# EAGLE design KELU1-0233 (EAGLE 7.6.0)
ESKD_DATE1: 50|51|46|48|49|46|50|48|49|57; ESKD_DESCRIPTION1: 193|235|238|234|32|226|251|239|240|255|236|232|242|229|235|255; ESKD_DESCRIPTION2: 209|245|229|236|224|32|253|235|229|234|242|240|232|247|229|241|234|224|255; ESKD_DESCRIPTION3: 239|240|232|237|246|232|239|232|224|235|252|237|224|255|46; ESKD_NUMBER: 75|69|76|85|49|46|48|50|51|51|46|48|48|49|32|221|51; ESKD_ORIENTATION: 48; ESKD_PAPER_SIZE: 49; ESKD_SHEETS: 49
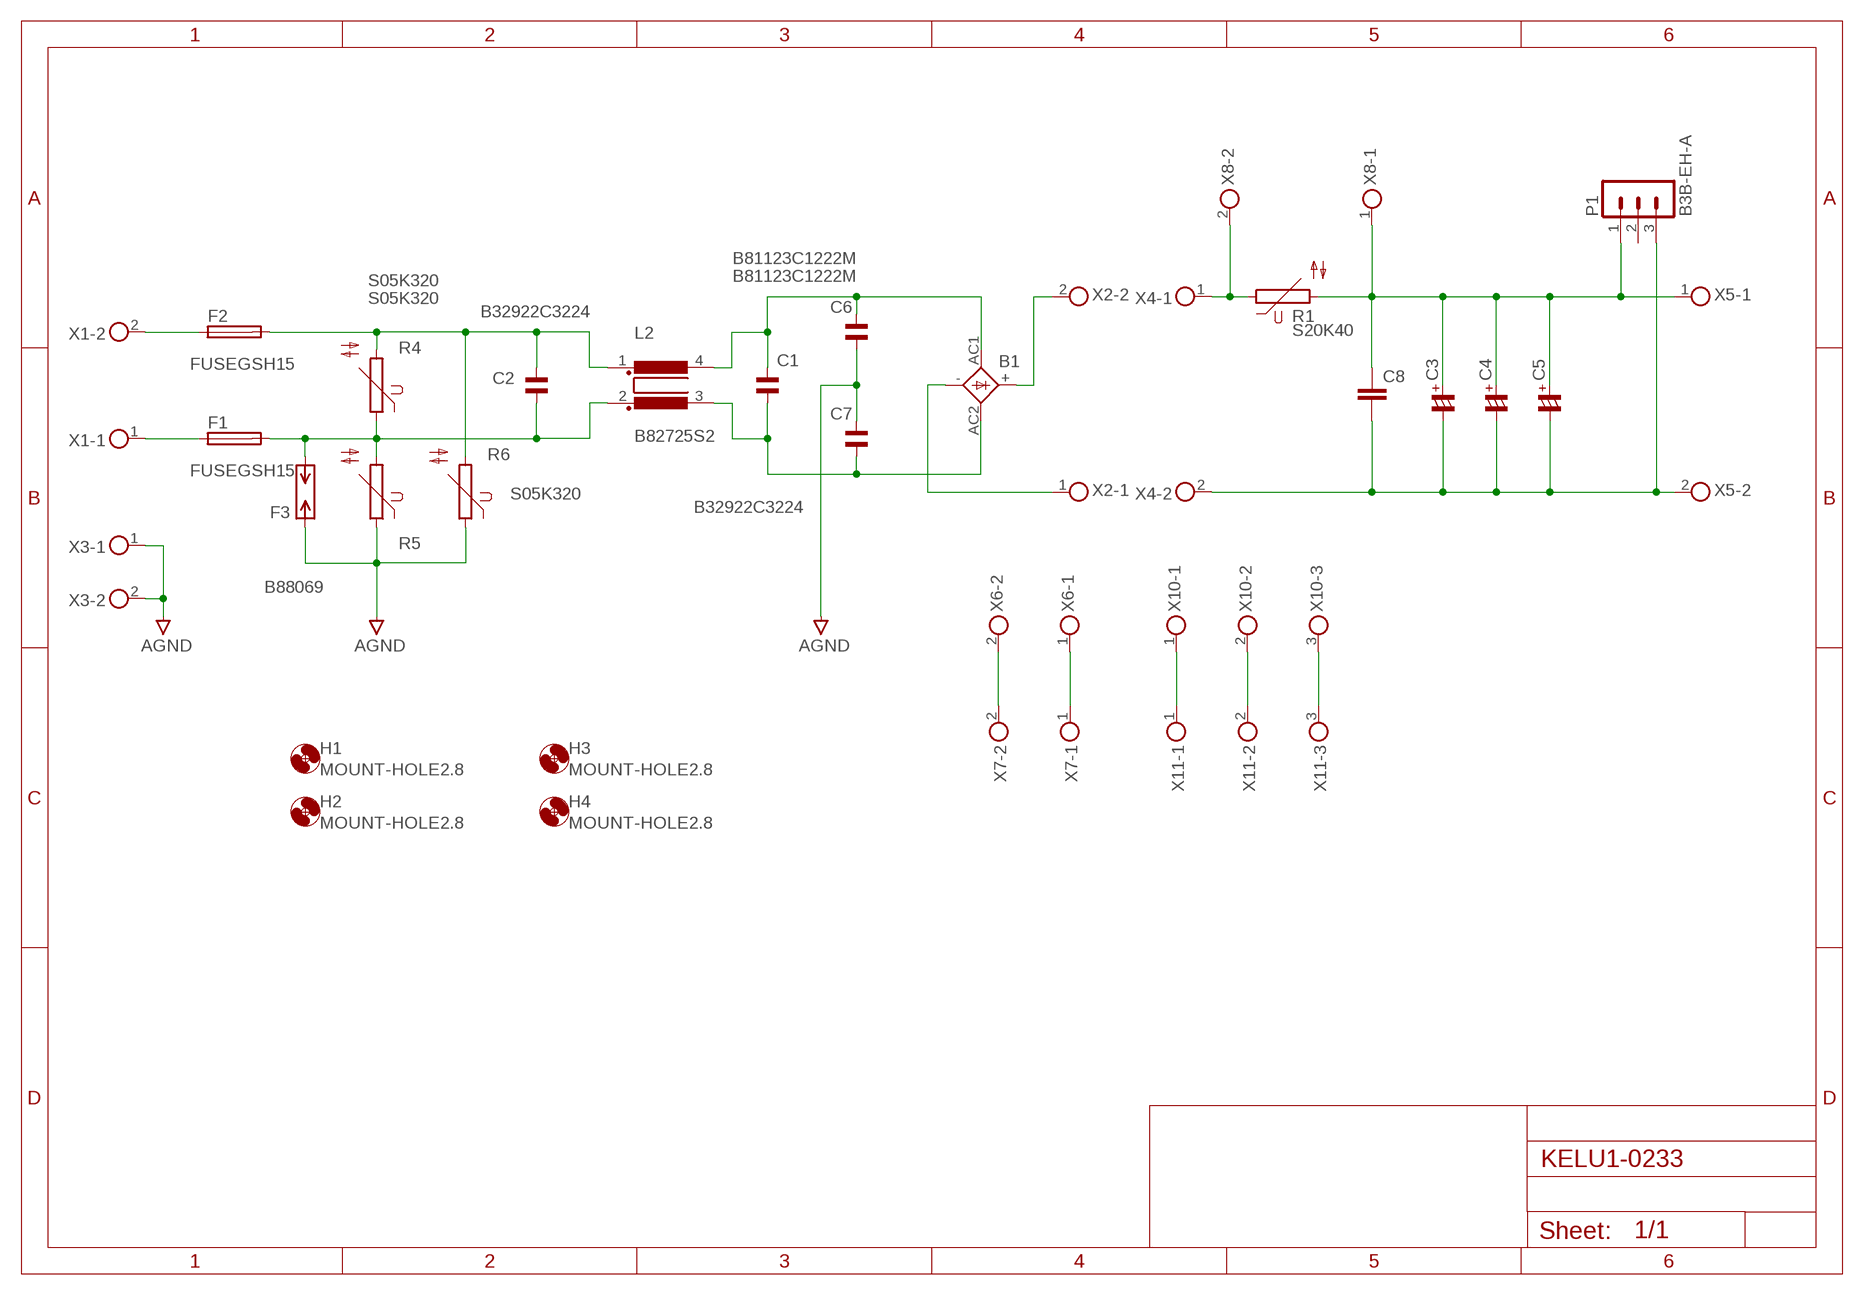
[diagram p0: schematic, sheet 1]

## Parts
B1  FBM  [FBM]
C1  B32922C3224  C-EU150-054X183  [C150-054X183]
C2  B32922C3224  C-EU150-054X183  [C150-054X183]
C3  CPOL-EUE7.5-18  [E7,5-18]
C4  CPOL-EUE7.5-18  [E7,5-18]
C5  CPOL-EUE7.5-18  [E7,5-18]
C6  B81123C1222M  C-EU150-054X183  [C150-054X183]
C7  B81123C1222M  C-EU150-054X183  [C150-054X183]
C8  C-EU102-043X133  [C102-043X133]
F1  FUSEGSH15  [GSH15]
F2  FUSEGSH15  [GSH15]
F3  B88069  [N81]
H1  MOUNT-HOLE2.8  [2,8]
H2  MOUNT-HOLE2.8  [2,8]
H3  MOUNT-HOLE2.8  [2,8]
H4  MOUNT-HOLE2.8  [2,8]
L2  B82725S2  [PLC]
P1  B3B-EH-A  [B3B-EH-A]
R1  S20K40  [S20K40]
R4  S05K320  S05K300  [S05K300]
R5  S05K320  S05K300  [S05K300]
R6  S05K320  S05K300  [S05K300]
X1  DG129-7.5-02P  [DG129-7.5-02P-14-00A]
X2  DG129-7.5-02P  [DG129-7.5-02P-14-00A]
X3  DG129-7.5-02P  [DG129-7.5-02P-14-00A]
X4  DG129-7.5-02P  [DG129-7.5-02P-14-00A]
X5  DG129-7.5-02P  [DG129-7.5-02P-14-00A]
X6  DG129-7.5-02P  [DG129-7.5-02P-14-00A]
X7  DG129-7.5-02P  [DG129-7.5-02P-14-00A]
X8  DG129-7.5-02P  [DG129-7.5-02P-14-00A]
X10  DG129-7.5-03P  [DG129-7.5-03P-14-00A]
X11  DG129-7.5-03P  [DG129-7.5-03P-14-00A]

## Nets
AGND: C6.2 C7.1 F3.P$1(A) R5.1 R6.1 X3.1 X3.2
N$1: C2.1 F2.2 L2.1 R4.2 R6.2
N$2: C2.2 F1.2 F3.P$2(B) L2.2 R4.1 R5.2
N$3: F1.1 X1.1
N$4: B1.AC1 C1.1 C6.1 L2.4
N$5: B1.AC2 C1.2 C7.2 L2.3
N$6: F2.1 X1.2
N$7: B1.- X2.1
N$8: B1.+ X2.2
N$9: C3.- C4.- C5.- C8.2 P1.3 X4.2 X5.2
N$10: C3.+ C4.+ C5.+ C8.1 P1.1 R1.2 X5.1 X8.1
N$11: R1.1 X4.1 X8.2
N$18: X6.2 X7.2
N$19: X6.1 X7.1
N$20: X10.1 X11.1
N$21: X10.2 X11.2
N$22: X10.3 X11.3
Unconnected: P1.2

## Library data of the parts
B1 = rectifier:FBM: GENERAL INSTRUMENT RECTIFIER
C1 C2 C6 C7 = rcl:C-EU: CAPACITOR, European symbol
C3-C5 = rcl:CPOL-EU: POLARIZED CAPACITOR, European symbol
C8 = resistor:C-EU: CAPACITOR, European symbol
F1 F2 = fuse:FUSE: Fuse
F3 = sparkgaps:B88069: Gas Discharge Tube 75V 5000A (5kA) ±20% 2 Pole Through Hole
H1-H4 = holes:MOUNT-HOLE: MOUNTING HOLE with drill center marker
L2 = B82725S2:B82725S2: Current-compensated ring core double chokes
P1 = con-jst-eh:B3B-EH-A: HEADER
R1 = varistor:S20K40: VARISTOR
R4-R6 = varistor:S05K300: VARISTOR
X1-X8 = DG129:DG129-7.5-02P
X10 X11 = DG129:DG129-7.5-03P

## Board
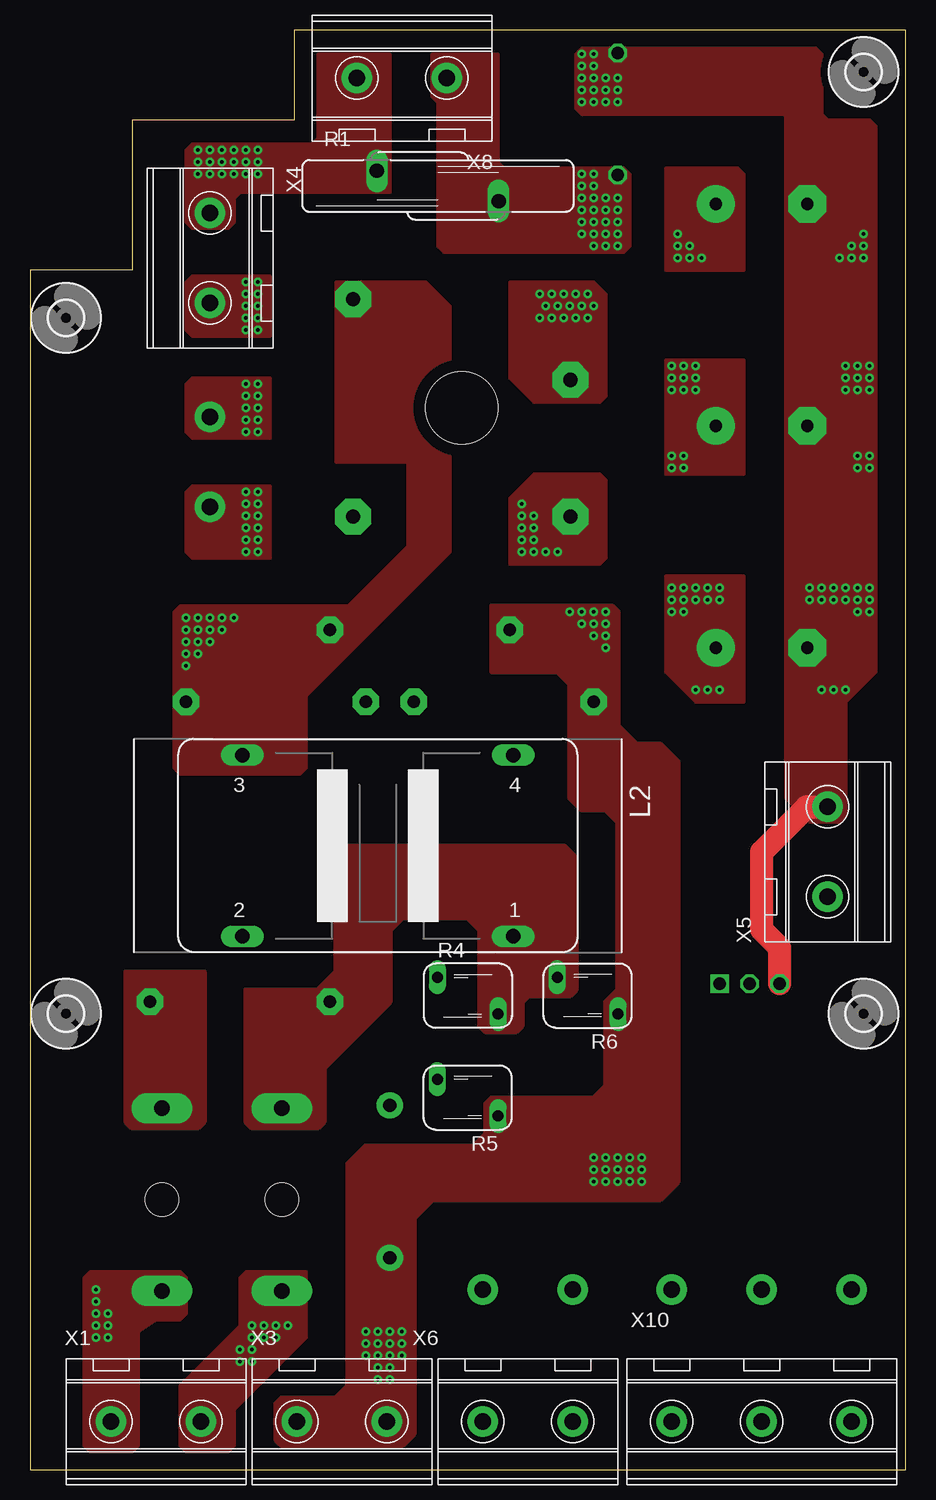
[diagram p1: board, top side]
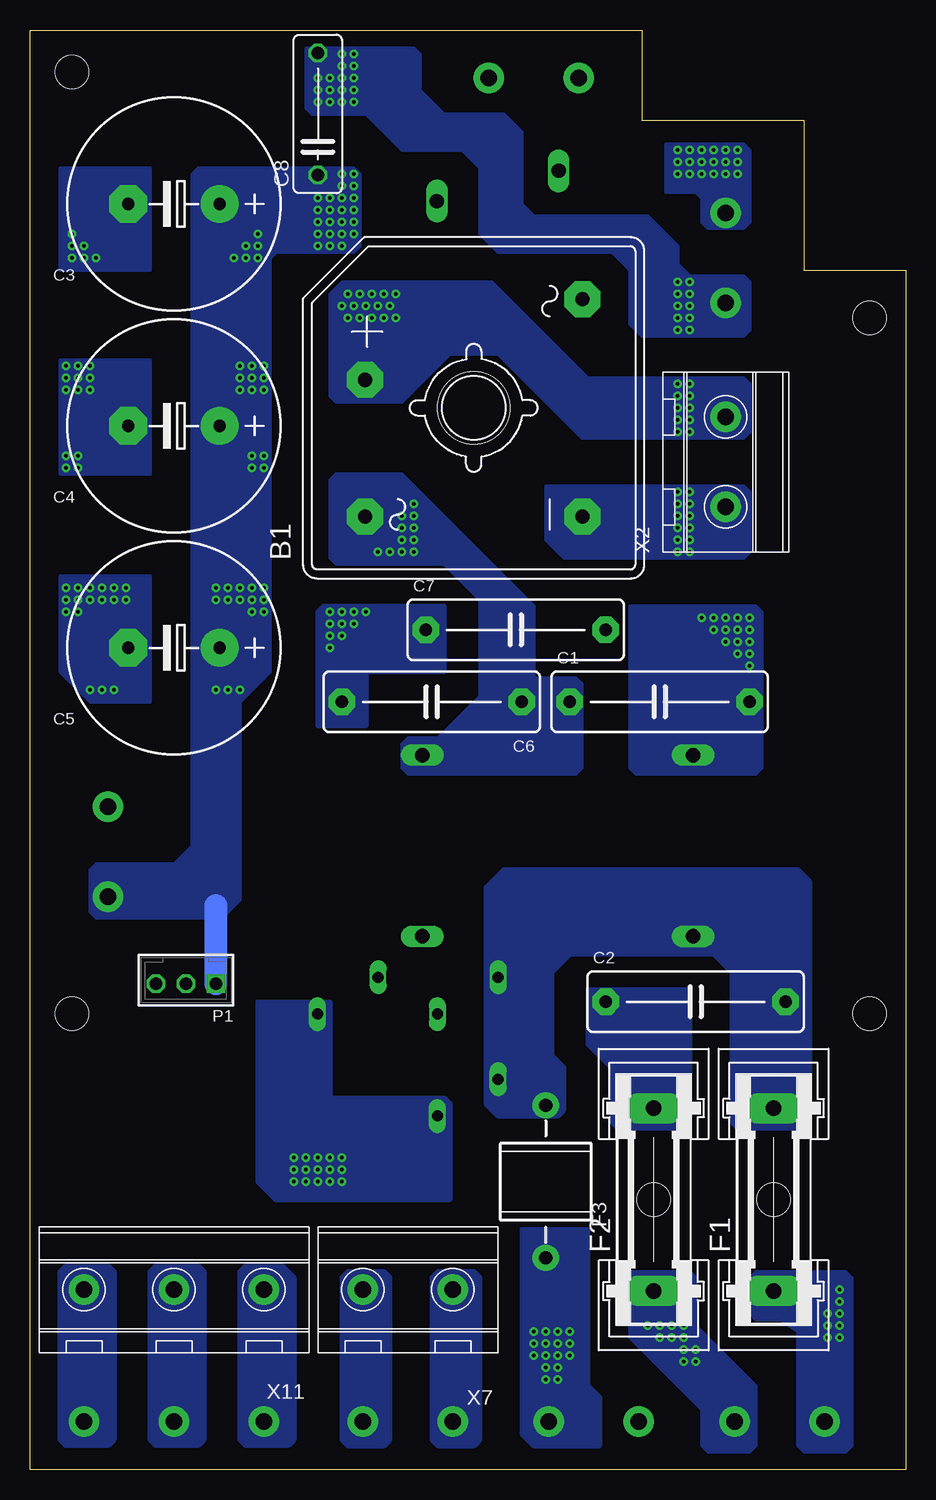
[diagram p2: board, bottom side, seen from below]

Size 73 x 120 mm. Coordinates in mm from the lower left corner, seen from the top.
Outline: 0,0 73,0 73,120 22,120 22,112.5 8.5,112.5 8.5,100 0,100 0,0
Copper layers (1*16): Top 0.035mm / dielectric 1.5mm / Bottom 0.035mm
Design rules "default": minimum track width 10mil, minimum drill 24mil, track to track 8mil, track to pad 8mil, pad to pad 8mil, via to via 8mil, smd to smd 8mil, copper to edge 40mil, drill to drill 8mil, minimum pad ring 10mil, minimum via ring 8mil, stop-mask expansion 4mil, vias tented up to drill 0mil, thermal gap 10mil
Holes 6 mm at 36,88.5

### Footprints (pad centres in the part's own frame; a part is rotated, then mirrored left to right if it is on the bottom)
FBM = drill 1.194 pad 3 octagon: + 2.337,9.068; - -9.068,-9.068; AC1 -9.068,9.068; AC2 9.068,-9.068
C150-054X183 = drill 1.016 pad 2.184 octagon: 1 -7.493,0; 2 7.493,0
E7,5-18 = drill 1.016 pad 3.15: + -3.81,0 | drill 1.016 pad 3.15 octagon: - 3.81,0
C102-043X133 = drill 1.016 octagon: 1 -5.08,0; 2 5.08,0
GSH15 = drill 1.321 pad 2.54 long: 1 -7.62,0; 2 7.62,0 | hole 2.794: 0,0
N81 = drill 1.1 pad 2.184: P$1 -6.35,0; P$2 6.35,0
2,8 = hole 2.8: 0,0
PLC = drill 1.194 long: 1 -11.303,7.544; 2 11.303,7.544; 3 11.303,-7.544; 4 -11.303,-7.544
B3B-EH-A = drill 1.016 square: 1 -2.5,0 | drill 1.016 octagon: 2 0,0; 3 2.5,0
S20K40 = drill 1.194 long: 1 -1.27,-5.08; 2 1.27,5.08
S05K300 = drill 0.914 long: 1 -1.524,-2.54; 2 1.524,2.54
DG129-7.5-02P-14-00A = drill 1.4 pad 2.54: 1 -3.75,0; 2 3.75,0
DG129-7.5-03P-14-00A = drill 1.4 pad 2.54: 1 -7.5,0; 2 0,0; 3 7.5,0

### Placement (x,y rotation side)
B1  36,88.5 90 bottom
C1  20.5,64 0 bottom
C2  17.5,39 0 bottom
C3  61,105.5 180 bottom
C4  61,87 180 bottom
C5  61,68.5 180 bottom
C6  39.5,64 180 bottom
C7  32.5,70 0 bottom
C8  49,113 90 bottom
F1  11,22.5 90 bottom
F2  21,22.5 90 bottom
F3  30,24 90 bottom
H1  3,38 0 top
H2  69.5,38 0 top
H3  3,96 0 top
H4  69.5,116.5 0 top
L2  29,52 180 top
P1  60,40.5 180 bottom
R1  34,107 270 top
R4  36.5,39.5 270 top
R5  36.5,31 90 top
R6  46.5,39.5 90 top
X1  10.5,4 0 top
X2  15,84 90 bottom
X3  26,4 0 top
X4  15,101 270 top
X5  66.5,51.5 90 top
X6  41.5,4 0 top
X7  41.5,15 180 bottom
X8  31,116 180 top
X10  61,4 0 top
X11  61,15 180 bottom

### Tracks (layer width: path | path; a pad name or v marks a point on that pad's centre or on a via)
AGND  (via drill 0.3)
  other vias: 45,71.5 46,71.5 47,71.5 48,71.5 48,70.5 48,69.5 47,70.5 46,70.5 47,69.5 48,68.5 47,26 48,26 49,26 50,26 51,26 51,25 51,24 50,24 50,25 49,25 49,24 48,24 48,25 47,25 47,24 28,11.5 29,11.5 30,11.5 31,11.5 31,10.5 31,9.5 30,9.5 30,10.5 29,10.5 28,10.5 28,9.5 29,9.5 29,8.5 30,8.5 29,7.5 30,7.5
  pour Top (no thermals): 38.5,66.5 38.5,72 48.5,72 49,71.5 49,62 50.5,60.5 52.5,60.5 54,59 54,24 52.5,22.5 33.5,22.5 32,21 32,3 31,2 21,2 20.5,2.5 20.5,5.5 21,6 25.5,6 26.5,7 26.5,25.5 28,27 37,27 38,28 38,30.5 38.5,31 47,31 48,32 48,39 49,40 49,54 48,55 46,55 45,56 45,65.5 44,66.5
  pour Bottom (no thermals): 25.5,2 25.5,6 26.5,7 26.5,20 32,20 32,3 31,2
  pour Bottom (no thermals): 38,30.5 38,22.5 52.5,22.5 54,24 54,39 48,39 48,31 38.5,31
  pour Bottom (no thermals): 38.5,72 38.5,66.5 45,66.5 45,62 49,62 49,71.5 48.5,72
N$1
  pour Top (no thermals): 18.5,28.5 18,29 18,40 24,40 25.5,41.5 25.5,51 26.5,52 44.5,52 45.5,51 45.5,40 45,39.5 41.5,39.5 41,39 41,37 40.5,36.5 38,36.5 37.5,37 37.5,45 36.5,46 31,46 30,45 30,39 24.5,33.5 24.5,29 24,28.5
  pour Bottom (no thermals): 18.5,28.5 18,29 18,40 26.5,40 26.5,35.5 24.5,33.5 24.5,29 24,28.5
N$2
  pour Bottom (no thermals): 8.5,28.5 8,29 8,49 9,50 33.5,50 35,48.5 35,30.5 34,29.5 29,29.5 28.5,30 28.5,33.5 29.5,34.5 29.5,41.5 28,43 16,43 14.5,41.5 14.5,29 14,28.5
  pour Top (no thermals): 14,28.5 8.5,28.5 8,29 8,41.5 14.5,41.5 14.5,29
N$3  (via drill 0.3)
  other vias: 5.5,11 6.5,12 6.5,11 6.5,13 5.5,12 5.5,13 5.5,14 5.5,15
  pour Top (no thermals): 12.5,16.5 5,16.5 4.5,16 4.5,2 5,1.5 8.5,1.5 9,2 9,11.5 10.5,12.5 12.5,12.5 13,13 13,16
  pour Bottom (no thermals): 4.5,2 4.5,16 5,16.5 12.5,16.5 13,16 13,13 12.5,12.5 10.5,12.5 9,11.5 9,2 8.5,1.5 5,1.5
N$4  (via drill 0.3)
  other vias: 41,76.5 41,77.5 41,78.5 41,79.5 41,80.5 42,79.5 42,78.5 42,77.5 42,76.5 43,76.5 44,76.5
  pour Bottom (no thermals): 41.5,61 42,60.5 42,58.5 41.5,58 27.5,58 27,58.5 27,65.5 27.5,66 31,66 31,72 42,83 47.5,83 48,82.5 48,76 47.5,75.5 38.5,75.5 35.5,72.5 35.5,64.5 39,61
  pour Top (no thermals): 48,82.5 47.5,83 42,83 40,81 40,75.5 47.5,75.5 48,76
N$5  (via drill 0.3)
  other vias: 13,70 15,71 14,71 13,71 15,70 13,69 16,71 14,70 13,68 14,69 16,70 17,71 15,69 14,68 13,67
  pour Top (no thermals): 22.5,58 12.5,58 12,58.5 12,71.5 12.5,72 26.5,72 31.5,77 31.5,84 25.5,84 25.5,99 33,99 35,97 35,76.5 23,64.5 23,58.5
  pour Bottom (no thermals): 12,58.5 12,71.5 12.5,72 23,72 23,58.5 22.5,58 12.5,58
N$6  (via drill 0.3)
  other vias: 19.5,11 18.5,11 21.5,12 20.5,12 19.5,12 18.5,12 18.5,9 17.5,9 17.5,10 18.5,10 20.5,11
  pour Top (no thermals): 18,16.5 17.5,16 17.5,12 12.5,7 12.5,2 13,1.5 16.5,1.5 17,2 17,5 23,11 23,16.5
  pour Bottom (no thermals): 12.5,2 12.5,7 17.5,12 17.5,16 18,16.5 23,16.5 23,11 17,5 17,2 16.5,1.5 13,1.5
N$7  (via drill 0.3)
  other vias: 19,81.5 18,81.5 18,80.5 19,80.5 19,79.5 18,79.5 18,78.5 19,78.5 19,77.5 18,77.5 18,76.5 19,76.5
  pour Bottom (no thermals): 13.5,82 30,82 30,77.5 28.5,76 13.5,76 13,76.5 13,81.5
  pour Top (no thermals): 13,81.5 13.5,82 20,82 20,76 13.5,76 13,76.5
N$8  (via drill 0.3)
  other vias: 42.5,98 43.5,98 44.5,98 45.5,98 46.5,98 47,97 46,97 45,97 44,97 43,97 42.5,96 43.5,96 44.5,96 45.5,96 46.5,96 19,90.5 18,90.5 19,89.5 19,88.5 19,87.5 18,87.5 18,88.5 18,89.5 19,86.5 18,86.5
  pour Bottom (no thermals): 13.5,86 27,86 34,93 38,93 42,89 47.5,89 48,89.5 48,98 47,99 34.5,99 26.5,91 13.5,91 13,90.5 13,86.5
  pour Top (no thermals): 42,89 47.5,89 48,89.5 48,98 47,99 40,99 40,91
  pour Top (no thermals): 13.5,91 13,90.5 13,86.5 13.5,86 20,86 20,91
N$9  (via drill 0.3)
  Top 1.93: P1.3 62.5,43.5 61,45 61,51.5 64.75,55.25 X5.2
  other vias: 46,118 47,118 46,117 47,117 46,116 47,116 46,115 47,115 46,114 47,114 48,114 48,115 48,116 49,116 49,115 49,114 19,99 18,99 18,98 19,98 19,97 18,97 18,96 19,96 19,95 18,95 70,73.5 69,73.5 68,73.5 67,73.5 66,73.5 65,73.5 65,72.5 66,72.5 67,72.5 68,72.5 69,72.5 70,72.5 70,71.5 69,71.5 68,65 67,65 66,65 70,92 69,92 68,92 68,91 69,91 70,91 70,90 69,90 68,90 70,83.5 69,83.5 69,84.5 70,84.5 69.5,101 68.5,101 67.5,101 68.5,102 69.5,102 69.5,103
  pour Bottom (no thermals): 13.5,99.5 18,99.5 19,100.5 19,102 21.5,104.5 31,104.5 32,105.5 32,111.5 33.5,113 38.5,113 40.5,115 40.5,118 41,118.5 50,118.5 50,113.5 49.5,113 45,113 42,110 37,110 35.5,108.5 35.5,103 34,101.5 24.5,101.5 23,100 23,95.5 22,94.5 13.5,94.5 13,95 13,99
  pour Top (no thermals): 46,118.5 65.5,118.5 66,118 66,113 66.5,112.5 70,112.5 70.5,112 70.5,66.5 68,64 68,54.5 67.5,54 65,54 63,56 63,113 46,113 45.5,113.5 45.5,118
  pour Top (no thermals): 13,99 13.5,99.5 20,99.5 20,94.5 13.5,94.5 13,95
  pour Bottom (no thermals): 63,74.5 70.5,74.5 70.5,66.5 68,64 63,64
  pour Bottom (no thermals): 63,92.5 70.5,92.5 70.5,83 63,83
  pour Bottom (no thermals): 63,100 70.5,100 70.5,108.5 63,108.5
N$10  (via drill 0.3)
  Bottom 1.93: P1.1 57.5,47
  other vias: 46,108 47,108 47,107 46,107 46,106 47,106 46,105 47,105 47,104 46,104 46,103 47,103 47,102 48,102 49,102 49,103 48,103 48,104 49,104 49,105 48,105 48,106 49,106 53.5,73.5 54.5,73.5 55.5,73.5 56.5,73.5 57.5,73.5 57.5,72.5 56.5,72.5 55.5,72.5 54.5,72.5 53.5,72.5 53.5,71.5 54.5,71.5 55.5,65 56.5,65 57.5,65 53.5,92 54.5,92 54.5,91 53.5,91 53.5,90 54.5,90 55.5,90 55.5,91 55.5,92 53.5,83.5 54.5,83.5 54.5,84.5 53.5,84.5 54,101 55,101 55,102 54,102 54,103 56,101
  pour Top (no thermals): 33.5,118 39,118 39,109 39.5,108.5 49.5,108.5 50,108 50,102 49.5,101.5 34.5,101.5 34,102 34,114 33.5,114.5
  pour Bottom (no thermals): 46,108.5 59,108.5 59.5,108 59.5,52 61,50.5 67.5,50.5 68,50 68,46.5 67.5,46 57,46 55.5,47.5 55.5,64 53,66.5 53,101 52.5,101.5 46,101.5 45.5,102 45.5,108
  pour Top (no thermals): 53,74.5 59.5,74.5 59.5,64 55.5,64 53,66.5
  pour Top (no thermals): 59.5,83 53,83 53,92.5 59.5,92.5
  pour Top (no thermals): 53,108.5 53,100 59.5,100 59.5,108 59,108.5
N$11  (via drill 0.3)
  other vias: 14,110 15,110 16,110 17,110 18,110 19,110 19,109 18,109 17,109 16,109 15,109 14,109 14,108 15,108 16,108 17,108 18,108 19,108
  pour Top (no thermals): 13.5,110.5 23.5,110.5 24,111 24,118 30,118 30,106.5 17.5,106.5 17,106 17,104 16.5,103.5 13.5,103.5 13,104 13,110
  pour Bottom (no thermals): 13.5,103.5 13,104 13,110 13.5,110.5 20,110.5 20,106.5 17.5,106.5 17,106 17,104 16.5,103.5
N$18
  pour Bottom (no thermals): 43,16 43.5,16.5 46.5,16.5 47,16 47,2.5 46.5,2 43.5,2 43,2.5
N$19
  pour Bottom (no thermals): 35.5,2.5 35.5,16 36,16.5 39,16.5 39.5,16 39.5,2.5 39,2 36,2
N$20
  pour Bottom (no thermals): 52,17 51,16 51,2.5 51.5,2 55,2 55.5,2.5 55.5,16.5 55,17
N$21
  pour Bottom (no thermals): 59,17 58.5,16.5 58.5,2.5 59,2 62.5,2 63,2.5 63,16.5 62.5,17
N$22
  pour Bottom (no thermals): 66.5,17 66,16.5 66,2.5 66.5,2 70,2 70.5,2.5 70.5,16.5 70,17